# Altium schematic sheet CurrentSensors.SchDoc: <Project Name>
size A3; ApprovedBy: <Appr.>; Author: <Author>; CompanyName: Infineon Technologies AG; Engineer: <Rel.>; Organization: Infineon Technologies AG; Address1: IFAG DES S PS; Address2: Am Campeon 1-12  -  85579 Neubiberg  -  Germany; Address3: 85579 Neubiberg; Address4: Germany; DocumentNumber: 7; Revision: <Rev.>; SheetNumber: 7; SheetTotal: 9; Release: RC00; PageSetup: Record=PageOptions|CenterHorizontal=True|CenterVertical=True|PrintScale=1.01|XCorrection=1.00|YCorrection=1.00|PrintKind=0|BorderSize=5000000|LeftOffset=0|BottomOffset=0|Orientation=2|PaperLength=1000|PaperWidth=1000|Scale=100|PaperSource=7|PrintQuality=-4|MediaType=1|DitherType=10|PaperKind=A3|PrintScaleMode=1; Doc_ConfidentialStatus: <Doc_ConfidentialStatus>; Doc_Preliminary: <Doc_Preliminary>
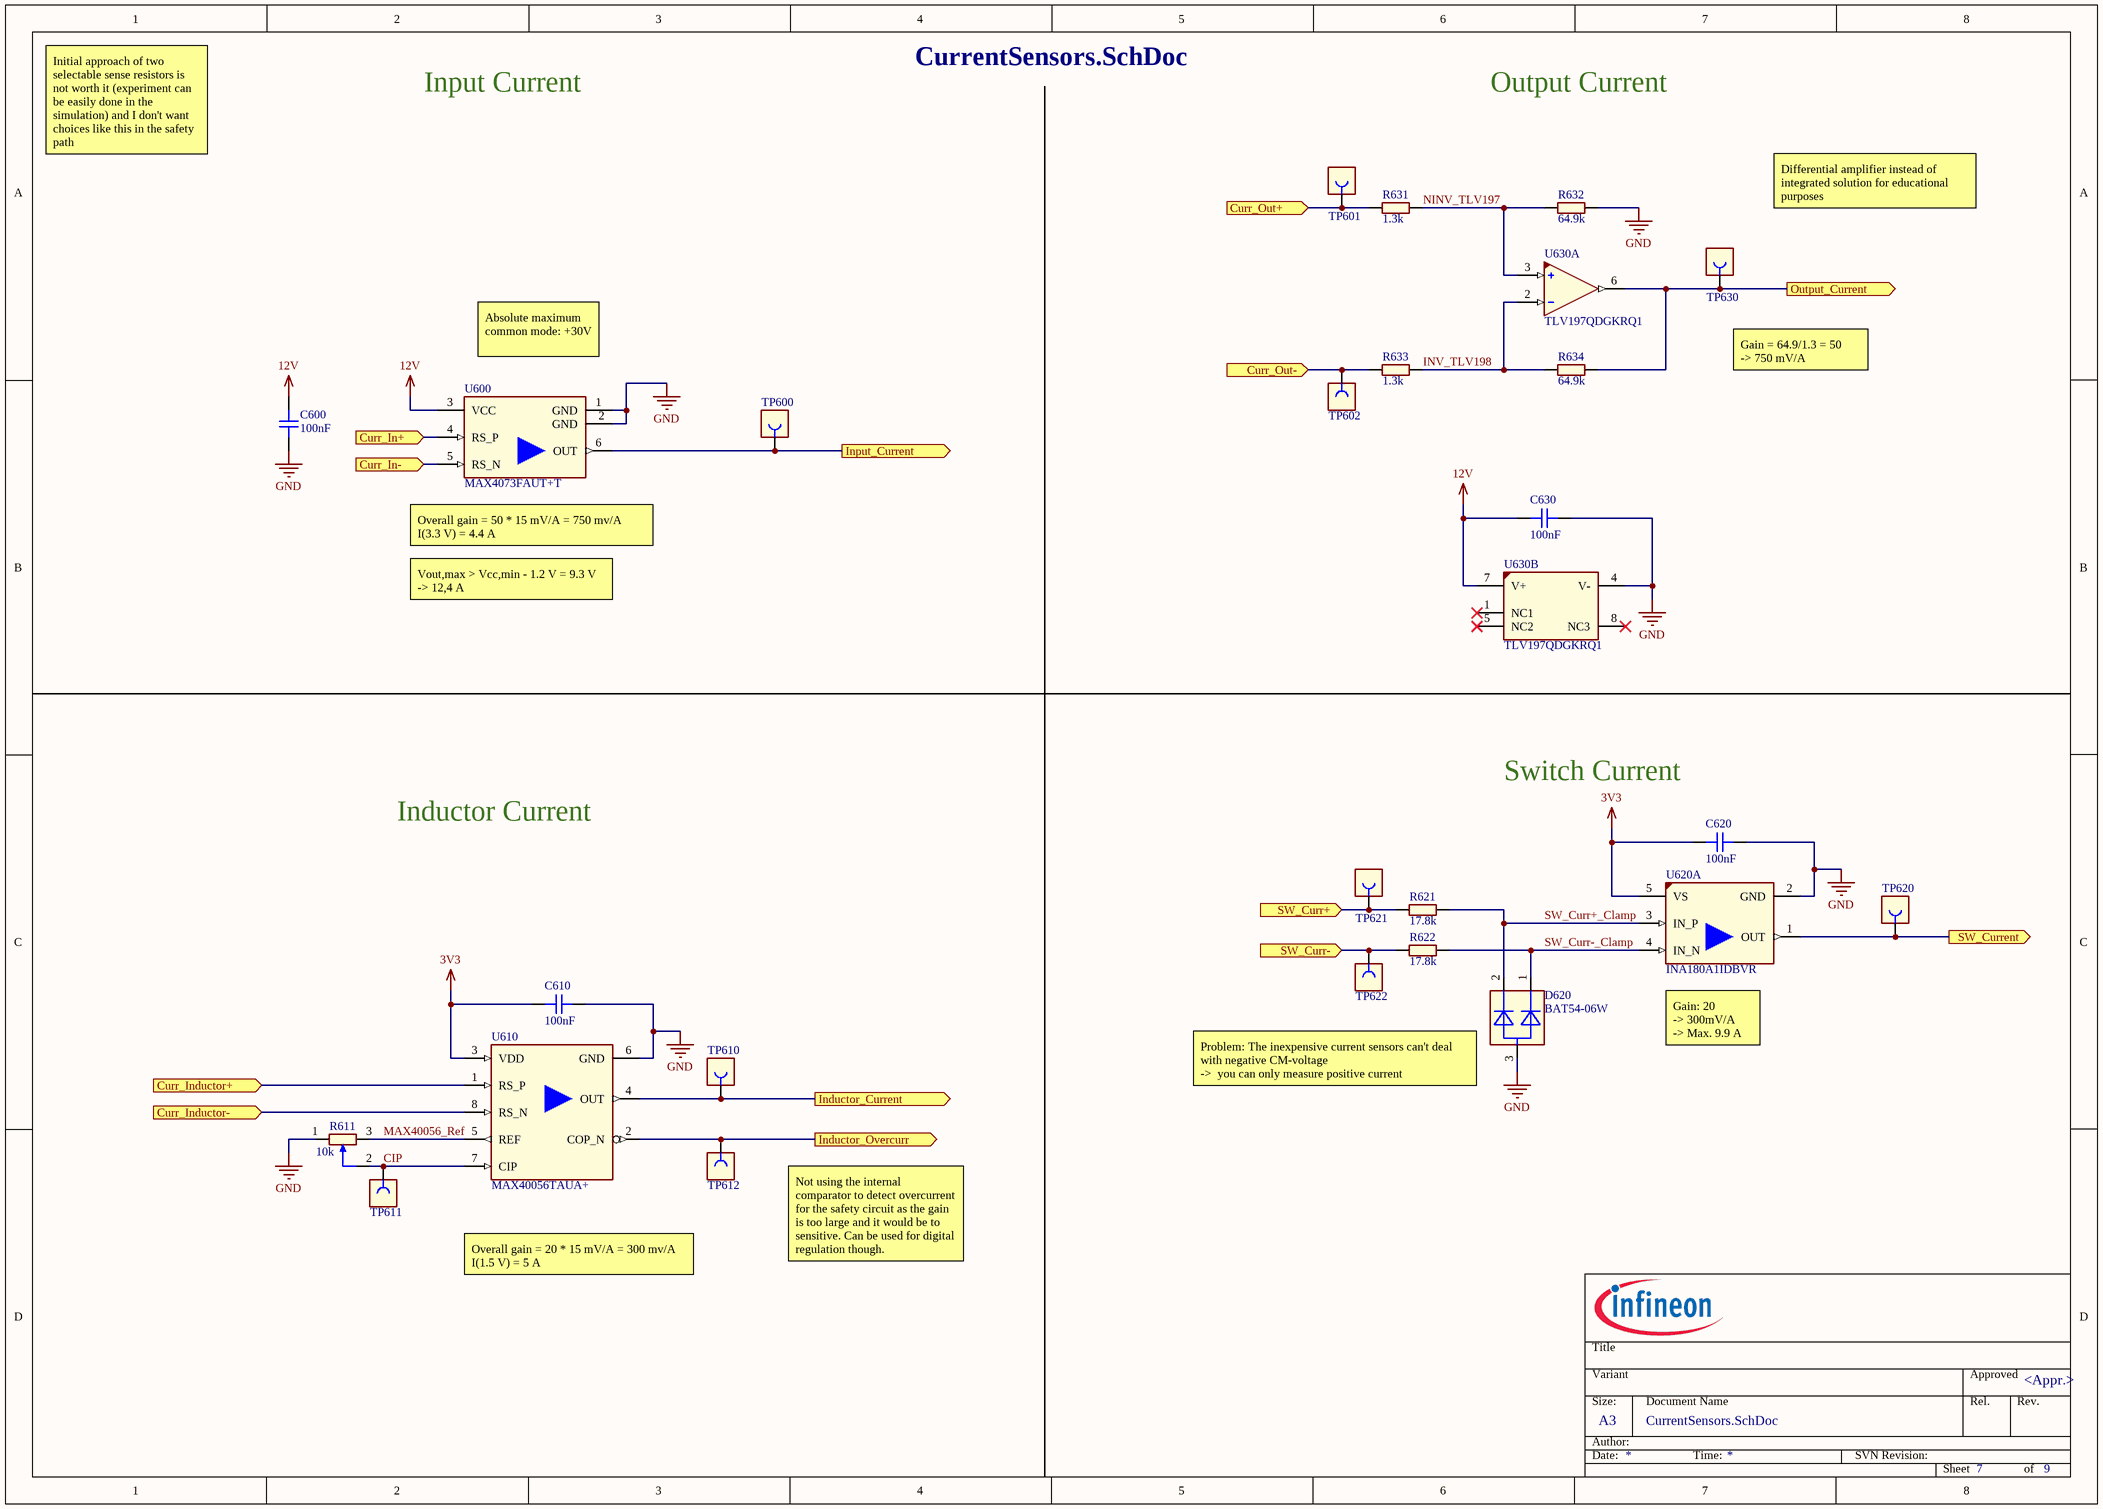
[diagram p0: CurrentSensors.SchDoc]

## Parts
C600  100nF  [CAPC1608X90N-2]
C610  100nF  [CAPC1608X90N-2]
C620  100nF  [CAPC1608X90N-2]
C630  100nF  [CAPC1608X90N-2]
D620  BAT54-06W  [SOT65P210X100-3N-1-V]
R611  10k  [POT-SMD-3361P]
R621  17.8k  [RESC1609X50N]
R622  17.8k  [RESC1609X50N]
R631  1.3k  [RESC1609X50N]
R632  64.9k  [RESC1609X50N]
R633  1.3k  [RESC1609X50N]
R634  64.9k  [RESC1609X50N]
TP600  S1751-46R  [CON-SMD-TT-S1751-46]  (value not drawn)
TP601  S1751-46R  [CON-SMD-TT-S1751-46]  (value not drawn)
TP602  S1751-46R  [CON-SMD-TT-S1751-46]  (value not drawn)
TP610  S1751-46R  [CON-SMD-TT-S1751-46]  (value not drawn)
TP611  S1751-46R  [CON-SMD-TT-S1751-46]  (value not drawn)
TP612  S1751-46R  [CON-SMD-TT-S1751-46]  (value not drawn)
TP620  S1751-46R  [CON-SMD-TT-S1751-46]  (value not drawn)
TP621  S1751-46R  [CON-SMD-TT-S1751-46]  (value not drawn)
TP622  S1751-46R  [CON-SMD-TT-S1751-46]  (value not drawn)
TP630  S1751-46R  [CON-SMD-TT-S1751-46]  (value not drawn)
U600  MAX4073FAUT+T  [SOT95P280X145-6N-2-V]
U610  MAX40056TAUA+  [SOP65P490X110-8N-4]
U620  INA180A1IDBVR  [SOT95P280X145-5N-2]  (part A of 2)
U630  TLV197QDGKRQ1  [SOP65P490X110-8N-V]  (parts A,B of 2)

## Ports
Curr_In+ (in), Curr_In- (in), Curr_Inductor+ (in), Curr_Inductor- (in), Curr_Out+ (in), Curr_Out- (in), Inductor_Current (out), Inductor_Overcurr (out), Input_Current (out), Output_Current (out), SW_Curr+ (in), SW_Curr- (in), SW_Current (out)

## Nets
3V3: C610.2 C620.2 U610.3(VDD) U620.5(VS)
12V: C600.2 C630.2 U600.3(VCC) U630.7(V+)
GND: C600.1 C610.1 C620.1 C630.1 D620.3(ANODE) R611.1 R632.1 U600.1(GND) U600.2(GND) U610.6(GND) U620.2(GND) U630.4(V-)
CIP: R611.2 TP611.1 U610.7(CIP)
Curr_In+: U600.4(RS_P) ; port Curr_In+
Curr_In-: U600.5(RS_N) ; port Curr_In-
Curr_Inductor+: U610.1(RS_P) ; port Curr_Inductor+
Curr_Inductor-: U610.8(RS_N) ; port Curr_Inductor-
Curr_Out+: R631.1 TP601.1 ; port Curr_Out+
Curr_Out-: R633.1 TP602.1 ; port Curr_Out-
Inductor_Current: TP610.1 U610.4(OUT) ; port Inductor_Current
Inductor_Overcurr: TP612.1 U610.2(COP_N) ; port Inductor_Overcurr
Input_Current: TP600.1 U600.6(OUT) ; port Input_Current
INV_TLV198: R633.2 R634.1 U630.2(IN_N)
MAX40056_Ref: R611.3 U610.5(REF)
NINV_TLV197: R631.2 R632.2 U630.3(IN_P)
Output_Current: R634.2 TP630.1 U630.6(OUT) ; port Output_Current
SW_Curr+: R621.2 TP621.1 ; port SW_Curr+
SW_Curr+_Clamp: D620.2(CATHODE2) R621.1 U620.3(IN_P)
SW_Curr-: R622.2 TP622.1 ; port SW_Curr-
SW_Curr-_Clamp: D620.1(CATHODE1) R622.1 U620.4(IN_N)
SW_Current: TP620.1 U620.1(OUT) ; port SW_Current

Not connected (* = marked no-connect by the designer): U630 1(NC1)* 5(NC2)* 8(NC3)*

## Notes on the sheet
- Input Current
- Output Current
- Initial approach of two selectable sense resistors is not worth it (experiment can be easily done in the simulation) and I don't want choices like this in the safety path
- Differential amplifier instead of integrated solution for educational purposes
- Absolute maximum common mode: +30V
- Gain = 64.9/1.3 = 50
  -> 750 mV/A
- (near U600) Overall gain = 50 * 15 mV/A = 750 mv/A
  I(3.3 V) = 4.4 A
- Vout,max > Vcc,min - 1.2 V = 9.3 V
  -> 12,4 A
- Switch Current
- Inductor Current
- (near U620) Gain: 20
  -> 300mV/A
  -> Max. 9.9 A
- (near D620) Problem: The inexpensive current sensors can't deal with negative CM-voltage
  ->  you can only measure positive current
- Not using the internal comparator to detect overcurrent for the safety circuit as the gain is too large and it would be to sensitive. Can be used for digital regulation though.
- Overall gain = 20 * 15 mV/A = 300 mv/A
  I(1.5 V) = 5 A
- Title
- Variant
- Approved
- Date:
- Author:
- Size:
- A3
- Document Name
- Time:
- SVN Revision:
- Rel.
- Rev.
- Sheet
- of

## Library data of the parts
C600 C610 C620 C630 = 479045: CAP / CERA / 100nF / 50V / 10% / X7R (EIA) / -55°C to 125°C / 0603 / SMD / -; Multiple Parts: No; Manufacturer: AVX; Manufacturer Order Number: 06035C104KAT2A; Symbol Type: Capacitor; Single; Standard; 2 Pins; Alternate View: Yes; Article Number: 479045; Version Number: V01; Combined Parameters: TC:X7R (EIA);Tol.:-10%/+10%;Vdc:50V; QuickPick: 100nF / 50V / 10% / X7R (EIA) / 0603; Type: Standard; Style: Single; ComponentStatus: Released; PLMStatus: Active; Part Type: Capacitor; Value: 100nF; Tolerance Neg: 10%; Tolerance Pos: 10%; Application: Standard; Technology: Ceramic; Temperature min: -55; Temperature max: 125; Temperature Range: Military; ROHS Compliant: Y; Automotive Qualified: No; PackageReference: 0603; ComponentLink1Description: Vendor WebSite; ComponentLink1URL: http://www.avx.com; ComponentLink2Description: Datasheet; ComponentLink2URL: http://webnetprod.muc.infineon.com/PCBPortal_Prod/WorkFlows/AltiumComponent/StandardDocumentation?Versionid=479046; Supplier 1: Farnell; Supplier Part Number 1: 2280883; Supplier 2: DigiKey; Supplier Part Number 2: 478-5052-2-ND; Supplier 3: Mouser; Supplier Part Number 3: 581-06035C104KAT2A; Second Source allowed: Yes; Voltage DC (max): 50V; Package Description: Capacitor,non-polarized,Chip;1.60mm L X 0.81mm W X 0.90mm H
D620 = 646372: Silicon Schottky Diodes; Manufacturer: Infineon Technologies; Symbol type: Dual Diode Symbol 3 Pins, 1 Cathode, 2 Cathode, 3 Anode; Article Number: 646372; Version Number: V01; Combined Parameters: Vf:800mV;If:200mA;Ur:30V;Ir:2uA;Pmax:230mW; QuickPick: Schottky Diode / PG-SOT323-3-1; Style: Dual; Automotive Qualified: AEC Q101; ComponentStatus: Released; PLMStatus: Active; Second Source allowed: Yes; Voltage DC (max): na; Part Type: Diode; Manufacturer Order Number: BAT54-06W; Value: BAT54-06W; Type: Schottky Diode; Application: Standard; Temperature min: -65; Temperature max: 150; Temperature Range: Military; ROHS Compliant: Y; PackageReference: PG-SOT323-3-1; ComponentLink1Description: Vendor WebSite; ComponentLink1URL: https://www.infineon.com/; ComponentLink2Description: Datasheet; ComponentLink2URL: http://webnetprod.muc.infineon.com/PCBPortal_Prod/WorkFlows/AltiumComponent/StandardDocumentation?Versionid=646373; Supplier 1: Farnell; Supplier Part Number 1: 2787842; Supplier 2: DigiKey; Supplier Part Number 2: BAT5406WH6327XTSA1TR-ND; Supplier 3: Mouser; Package Description: SOT,0.65mm pitch;3 pin,1.25mm W X 2.00mm L X 1.00mm H body
R611 = 630020: RES / VAR / 10k / 500mW / 10% / 100ppm/K / -55°C to 125°C /  3 pin, 7.04 mm L X 6.71 mm W X 5.84 mm H Body / SMD / -; Multiple Parts: No; Manufacturer: Bourns; Manufacturer Order Number: 3361P-1-103GLF; Alternate View: Yes; Symbol Type: Resistor; Single; Variable; 3 Pins; Article Number: 630020; Version Number: V01; Combined Parameters: TCR:100ppm/K;Tol.:-10%/+10%;Vdc:-;Idc:-;P:500mW; QuickPick: 10k / 10% / 0.5 / SMD; Style: Single; ComponentStatus: Released; PLMStatus: Active; Part Type: Resistor; Value: 10k; Tolerance Neg: 10%; Tolerance Pos: 10%; Type: Variable; Application: Standard; Temperature min: -55; Temperature max: 125; Temperature Range: Military; ROHS Compliant: Y; Automotive Qualified: No; PackageReference: SMD; ComponentLink1Description: Vendor WebSite; ComponentLink1URL: http://www.bourns.com; ComponentLink2Description: Datasheet; ComponentLink2URL: http://webnetprod.muc.infineon.com/PCBPortal_Prod/WorkFlows/AltiumComponent/StandardDocumentation?Versionid=630021; Supplier 1: Farnell; Supplier Part Number 1: 1696060; Supplier 2: DigiKey; Supplier Part Number 2: 3361P-103GLFCT-ND; Supplier 3: Mouser; Supplier Part Number 3: 652-3361P-1-103GLF; Second Source allowed: Yes; Package Description: Potentiometer, SMD; 3 pin, 7.04 mm L X 6.71 mm W X 5.84 mm H Body
R621 R622 = 346302: RES / STD / 17.8k / 100mW / 1% / 100ppm/K / -55°C to 155°C / 0603 / SMD / -; Multiple Parts: No; Legacy PartNumber: RES01801283; Manufacturer: Vishay; Manufacturer Order Number: CRCW060317K8FK; Symbol Type: Resistor; Single; Standard; 2 Pins; Alternate View: Yes; Article Number: 346302; Version Number: V01; Combined Parameters: TCR:100ppm/K;Tol.:-1%/+1%;Vdc:75V;Idc:-;P:100mW; QuickPick: 17.8k / 1% / 0.1 / 0603; Style: Single; Automotive Qualified: AEC Q200; ComponentStatus: Released; PLMStatus: Active; Voltage DC (max): 75V; Legacy DeviceID: RES01801283; Part Type: Resistor; Value: 17.8k; Tolerance Neg: 1%; Tolerance Pos: 1%; Type: Standard; Technology: Thick Film; Temperature min: -55; Temperature max: 155; Temperature Range: Military; ROHS Compliant: Y; PackageReference: 0603; ComponentLink1Description: Vendor WebSite; ComponentLink1URL: http://www.vishay.com; ComponentLink2Description: Datasheet; ComponentLink2URL: http://webnetprod.muc.infineon.com/PCBPortal_Prod/WorkFlows/AltiumComponent/StandardDocumentation?Versionid=346303; Supplier 1: Farnell; Supplier 2: DigiKey; Supplier 3: Mouser; Second Source allowed: Yes
R631 R633 = 345662: RES / STD / 1.3k / 100mW / 1% / 100ppm/K / -55°C to 155°C / 0603 / SMD / -; Multiple Parts: No; Legacy PartNumber: RES01801155; Manufacturer: Vishay; Manufacturer Order Number: CRCW06031K30FK; Symbol Type: Resistor; Single; Standard; 2 Pins; Alternate View: Yes; Article Number: 345662; Version Number: V01; Combined Parameters: TCR:100ppm/K;Tol.:-1%/+1%;Vdc:75V;Idc:-;P:100mW; QuickPick: 1.3k / 1% / 0.1 / 0603; Style: Single; Automotive Qualified: AEC Q200; ComponentStatus: Released; PLMStatus: Active; Voltage DC (max): 75V; Legacy DeviceID: RES01801155; Part Type: Resistor; Value: 1.3k; Tolerance Neg: 1%; Tolerance Pos: 1%; Type: Standard; Technology: Thick Film; Temperature min: -55; Temperature max: 155; Temperature Range: Military; ROHS Compliant: Y; PackageReference: 0603; ComponentLink1Description: Vendor WebSite; ComponentLink1URL: http://www.vishay.com; ComponentLink2Description: Datasheet; ComponentLink2URL: http://webnetprod.muc.infineon.com/PCBPortal_Prod/WorkFlows/AltiumComponent/StandardDocumentation?Versionid=345663; Supplier 1: Farnell; Supplier 2: DigiKey; Supplier 3: Mouser; Second Source allowed: Yes
R632 R634 = 346637: RES / STD / 64.9k / 100mW / 1% / 100ppm/K / -55°C to 155°C / 0603 / SMD / -; Multiple Parts: No; Legacy PartNumber: RES01801350; Manufacturer: Vishay; Manufacturer Order Number: CRCW060364K9FK; Symbol Type: Resistor; Single; Standard; 2 Pins; Alternate View: Yes; Article Number: 346637; Version Number: V01; Combined Parameters: TCR:100ppm/K;Tol.:-1%/+1%;Vdc:75V;Idc:-;P:100mW; QuickPick: 64.9k / 1% / 0.1 / 0603; Style: Single; Automotive Qualified: AEC Q200; ComponentStatus: Released; PLMStatus: Active; Voltage DC (max): 75V; Legacy DeviceID: RES01801350; Part Type: Resistor; Value: 64.9k; Tolerance Neg: 1%; Tolerance Pos: 1%; Type: Standard; Technology: Thick Film; Temperature min: -55; Temperature max: 155; Temperature Range: Military; ROHS Compliant: Y; PackageReference: 0603; ComponentLink1Description: Vendor WebSite; ComponentLink1URL: http://www.vishay.com; ComponentLink2Description: Datasheet; ComponentLink2URL: http://webnetprod.muc.infineon.com/PCBPortal_Prod/WorkFlows/AltiumComponent/StandardDocumentation?Versionid=346638; Supplier 1: Farnell; Supplier 2: DigiKey; Supplier 3: Mouser; Second Source allowed: Yes
TP600-TP602 TP610-TP612 TP620-TP622 TP630 = 387486: Test Terminal, Surface Mount (Tape and Reeled Components); Multiple Parts: No; Legacy PartNumber: CON01501015; Manufacturer: Harwin; Symbol Type: Connector, 1 Lead, Female; Alternate View: Yes; Article Number: 387486; Version Number: V01; Legacy DeviceID: HAR_S1751-46R; Combined Parameters: Board-to-Cable None (onboard);1x1;Mounting:SMT;Orient:None (onboard);Shielded:No; QuickPick: None (onboard) / Board-to-Cable; Style: Not Applicable; ComponentStatus: Released; PLMStatus: Active; Voltage DC (max): na; Part Type: Connector; Manufacturer Order Number: S1751-46R; Value: S1751-46R; Type: Board-to-Cable; Application: Test; Temperature min: 0; Temperature max: 0; Temperature Range: Military; ROHS Compliant: Y; Automotive Qualified: No; ComponentLink1Description: Vendor WebSite; ComponentLink1URL: http://www.harwin.com/; ComponentLink2Description: Datasheet; ComponentLink2URL: http://webnetprod.muc.infineon.com/PCBPortal_Prod/WorkFlows/AltiumComponent/StandardDocumentation?Versionid=387487; Supplier 1: Farnell; Supplier Part Number 1: 2411184; Supplier 2: DigiKey; Supplier Part Number 2: 952-1478-2-ND; Supplier 3: Mouser; Supplier Part Number 3: 855-S1751-46R; Second Source allowed: Yes; Package Description: Test Terminal, SMD, 3.25mm L X 1.65mm W X 2.15mm H body
U600 = 644045: Low-Cost, Voltage-Output, High-Side Current-Sense Amplifier; Manufacturer: Maxim Integrated Products; Alternate View: No; Article Number: 644045; Version Number: V01; Legacy DeviceID: MIP_MAX4073FAUT+T; Combined Parameters: Res.:-;Fmax:-; QuickPick: Amplifier / SOT23-6; Automotive Qualified: Yes; ComponentStatus: Released; PLMStatus: Active; Voltage DC (max): na; Symbol Type: Low-Cost, Voltage-Output, High-Side Current-Sense Amplifier; Multiple Parts: No; Part Type: Analog Parts; Manufacturer Order Number: MAX4073FAUT+T; Value: MAX4073FAUT+T; Type: Amplifier; Application: Power Supply; Temperature min: -40; Temperature max: 125; Temperature Range: Automotive; ROHS Compliant: Y; PackageReference: SOT23-6; ComponentLink1Description: Vendor WebSite; ComponentLink1URL: http://www.maxim-ic.com/; ComponentLink2Description: Datasheet; ComponentLink2URL: http://webnetprod.muc.infineon.com/PCBPortal_Prod/WorkFlows/AltiumComponent/StandardDocumentation?Versionid=644046; Supplier 1: Farnell; Supplier Part Number 1: 2515284; Supplier 2: DigiKey; Supplier Part Number 2: MAX4073FAUT+TCT-ND; Supplier 3: Mouser; Supplier Part Number 3: 700-MAX4073FAUT+T; Second Source allowed: Yes; Package Description: SOT,0.95mm pitch;6 pin,1.625mm W X 2.90mm L X 1.45mm H body
U610 = 645975: Current Sense Amplifiers Current-Sense Amplifier W / PWM Rejection; Manufacturer: Maxim Integrated Products; Alternate View: No; Symbol Type: Bidirectional Current Sense Amplifier with PWM-Rejection; Article Number: 645975; Version Number: V01; Legacy DeviceID: MIP_MAX40056TAUA+; Combined Parameters: Res.:-;Fmax:-; QuickPick: Amplifier / uMAX-8; Automotive Qualified: AEC Q100; ComponentStatus: Released; PLMStatus: Active; Second Source allowed: Yes; Voltage DC (max): na; Multiple Parts: No; Part Type: Analog Parts; Manufacturer Order Number: MAX40056TAUA+; Value: MAX40056TAUA+; Type: Amplifier; Application: Power Electronics; Temperature min: -40; Temperature max: 125; Temperature Range: Automotive; ROHS Compliant: Y; PackageReference: uMAX-8; ComponentLink1Description: Vendor WebSite; ComponentLink1URL: http://www.maxim-ic.com/; ComponentLink2Description: Datasheet; ComponentLink2URL: http://webnetprod.muc.infineon.com/PCBPortal_Prod/WorkFlows/AltiumComponent/StandardDocumentation?Versionid=645976; Supplier 1: Farnell; Supplier Part Number 1: 3288156; Supplier 2: DigiKey; Supplier Part Number 2: 175-MAX40056TAUA+-ND; Supplier 3: Mouser; Supplier Part Number 3: 700-MAX40056TAUA+; Package Description: SOP,0.65mm pitch;8 pin,3.00mm W X 3.00mm L X 1.10mm H body
U620 = 646034: Low- and High-Side Voltage Output, Current-Sense Amplifier; Manufacturer: Texas Instruments; Symbol Type: 1-MHz, High-Precision Current Sense Amplifier; Alternate View: Yes; Article Number: 646034; Version Number: V01; Legacy DeviceID: TI_INA180A1IDBVR; Combined Parameters: Res.:-;Fmax:-; QuickPick: Amplifier / SOT-23 (DBV); Automotive Qualified: No; ComponentStatus: Released; PLMStatus: Active; Voltage DC (max): na; Multiple Parts: Yes; Part Type: Analog Parts; Manufacturer Order Number: INA180A1IDBVR; Value: INA180A1IDBVR; Type: Amplifier; Application: Power Electronics; Temperature min: -40; Temperature max: 125; Temperature Range: Automotive; ROHS Compliant: Y; PackageReference: SOT-23 (DBV); ComponentLink1Description: Vendor WebSite; ComponentLink1URL: http://www.ti.com; ComponentLink2Description: Datasheet; ComponentLink2URL: http://webnetprod.muc.infineon.com/PCBPortal_Prod/WorkFlows/AltiumComponent/StandardDocumentation?Versionid=646035; Supplier 1: Farnell; Supplier 2: DigiKey; Supplier Part Number 2: 296-47652-1-ND; Supplier 3: Mouser; Supplier Part Number 3: 595-INA180A1IDBVR; Second Source allowed: Yes; Package Description: SOT,0.95mm pitch;5 pin,1.60mm W X 2.90mm L X 1.45mm H body
U630 = 648334: Automotive, High-Voltage, Precision, Rail-to-Rail In, Rail-to-Rail Out Op Amp, Inverter and Motor Control Applications; Manufacturer: Texas Instruments; Symbol Type: High-Precision, Low-Noise, Rail-to-Rail Output, JFET Op Amp; Alternate View: Yes; Article Number: 648334; Version Number: V00; Legacy DeviceID: TI_TLV197QDGKRQ1; Combined Parameters: Res.:-;Fmax:-; QuickPick: Amplifier / VSSOP-8(DGK); Automotive Qualified: AEC Q100; ComponentStatus: Released; PLMStatus: Active; Voltage DC (max): na; Multiple Parts: Yes; Part Type: Analog Parts; Manufacturer Order Number: TLV197QDGKRQ1; Value: TLV197QDGKRQ1; Type: Amplifier; Application: Power Supply; Temperature min: -40; Temperature max: 125; Temperature Range: Automotive; ROHS Compliant: Y; PackageReference: VSSOP-8(DGK); ComponentLink1Description: Vendor WebSite; ComponentLink1URL: http://www.ti.com; ComponentLink2Description: Datasheet; ComponentLink2URL: http://webnetprod.muc.infineon.com/PCBPortal_Prod/WorkFlows/AltiumComponent/StandardDocumentation?Versionid=648335; Supplier 1: Farnell; Supplier 2: DigiKey; Supplier Part Number 2: 296-TLV197QDGKRQ1CT-ND; Supplier 3: Mouser; Supplier Part Number 3: 595-TLV197QDGKRQ1; Second Source allowed: Yes; Package Description: SOP,0.65mm pitch;8 pin,3.00mm W X 3.00mm L X 1.10mm H body